# EAGLE design Lagopus_B (EAGLE 8.0.0)
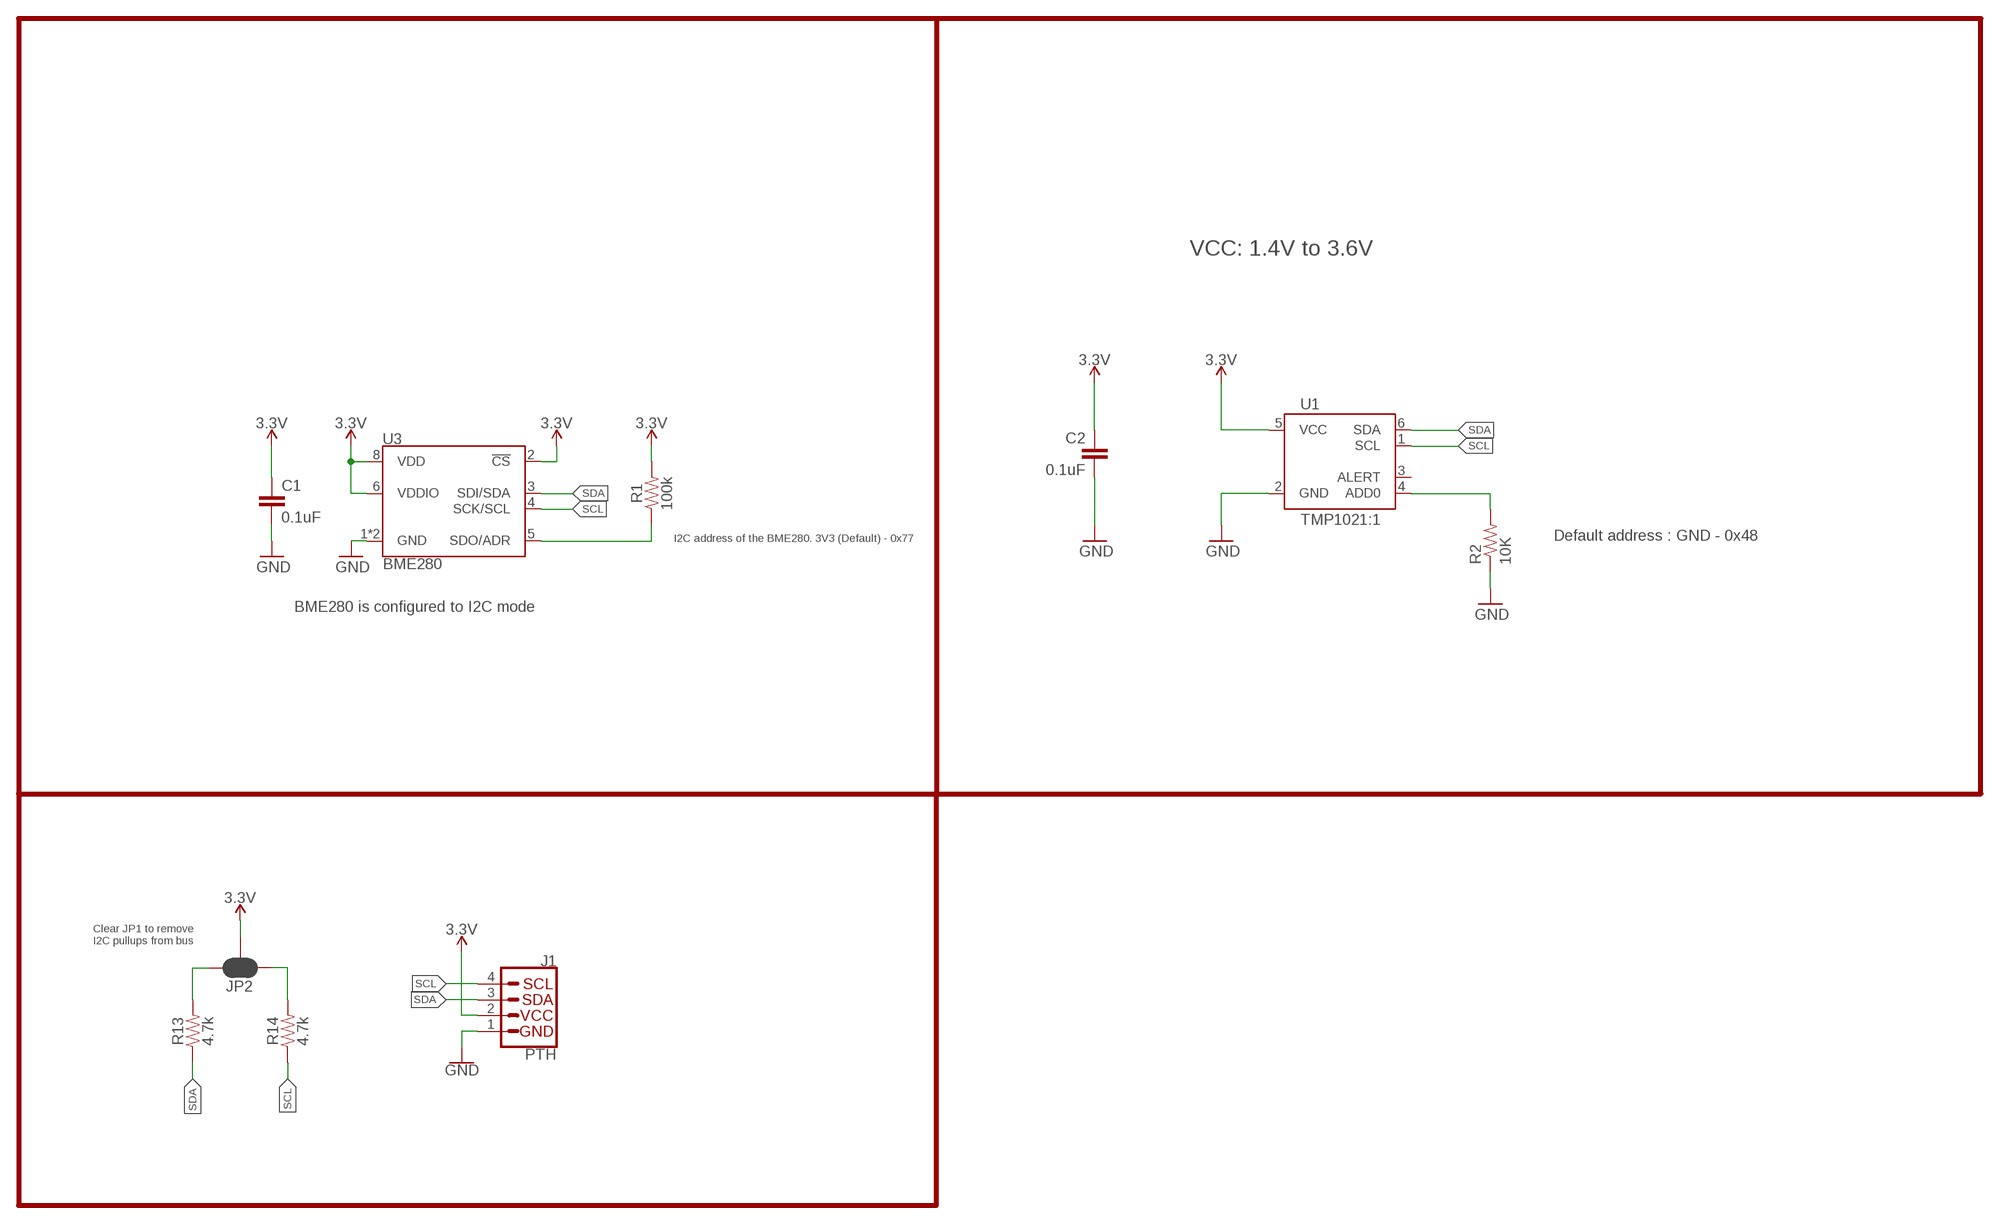
[diagram p0: schematic, sheet 1]

## Parts
C1  0.1uF  0.1UF-0603-25V-(+80/-20%)  [0603]
C2  0.1uF  0.1UF-25V(+80/-20%)(0603)  [0603-CAP]
J1  PTH  I2C_STANDARD_NO_SILK  [1X04_NO_SILK]
JP2  JUMPER-SMT_3_2-NC_PASTE_SILK  [SMT-JUMPER_3_2-NC_PASTE_SILK]
R1  100k  100KOHM-0603-1/10W-1%  [0603]
R2  10K  10KOHM-1/10W-1%(0603)0603  [0603-RES]
R13  4.7k  4.7KOHM-0603-1/10W-1%  [0603]
R14  4.7k  4.7KOHM-0603-1/10W-1%  [0603]
U1  TMP1021:1  [SOT563-2]
U3  BME280  [LGA-8-2.5X2.5]

## Nets
3.3V: C1.1 C2.1 J1.2(VCC) JP2.2 R1.2 U1.5(VCC) U3.2(!CS) U3.6(VDDIO) U3.8(VDD)
ADD0: R2.2 U1.4(ADD0)
GND: C1.2 C2.2 J1.1(GND) R2.1 U1.2(GND) U3.1(GND) U3.7(GND)
N$7: JP2.3 R13.2
N$8: JP2.1 R14.2
SCL: J1.4(SCL) R14.1 U1.1(SCL) U3.4(SCK/SCL)
SDA: J1.3(SDA) R13.1 U1.6(SDA) U3.3(SDI/SDA)
SDO/ADR: R1.1 U3.5(SDO/ADR)
Unconnected: U1.3(ALERT)

## Notes on the sheet
- VCC: 1.4V to 3.6V
- I2C address of the BME280. 3V3 (Default) - 0x77
- Default address : GND - 0x48
- BME280 is configured to I2C mode
- Clear JP1 to remove
  I2C pullups from bus

## Library data of the parts
C1 = SparkFun-Capacitors:0.1UF: 0.1µF ceramic capacitors A capacitor is a passive two-terminal electrical component used to store electrical energy temporarily in an electric field.; PROD_ID: CAP-00810
C2 = SparkFun-Capacitors:0.1UF-25V(+80/-20%)(0603): CAP-00810 Ceramic Standard decoupling cap; PROD_ID: CAP-00810
J1 = SparkX:I2C_STANDARD: SparkFun I2C Standard Pinout Header SparkFun has standardized on a pinout for all I2C based sensor breakouts. This pinout allows I2C boards to be plugged directly into the headers on Arduino Uno compatible boards, and to be daisy chained easily. Example SparkFun Products: SparkFun Atmospheric Sensor Breakout - BME280 <https://www.sparkfun.com/products/13676> SparkFun Altitude/Pressure Sensor Breakout - MPL3115A2 <https://www.sparkfun.com/products/11084> SparkFun TOF Range Finder Sensor - VL6180 <https://www.sparkfun.com/products/12785>
JP2 = SparkFun-Jumpers:JUMPER-SMT_3_2-NC_PASTE: Normally closed solder jumper (2 of 2 connections) This jumper has an aperture in the stencil to allow solder paste to bridge both connections. Both connections are normally closed (NC). Wick off the solder to open the connection(s). Reapply solder to reclose the connection(s).
R1 = SparkFun-Resistors:100KOHM: 100kΩ resistor A resistor is a passive two-terminal electrical component that implements electrical resistance as a circuit element. Resistors act to reduce current flow, and, at the same time, act to lower voltage levels within circuits. - Wikipedia; PROD_ID: RES-07828
R2 = SparkFun-Resistors:10KOHM-1/10W-1%(0603): RES-00824; PROD_ID: RES-00824
R13 R14 = SparkFun-Resistors:4.7KOHM: 4.7kΩ resistor A resistor is a passive two-terminal electrical component that implements electrical resistance as a circuit element. Resistors act to reduce current flow, and, at the same time, act to lower voltage levels within circuits. - Wikipedia; PROD_ID: RES-07857
U1 = SparkFun-Sensors:TMP102: I2C degC temp sensor; PROD_ID: IC-09303
U3 = SparkFun-Sensors:BME280: Bosch BME280 – Combined Humidity and Pressure Sensor The BME280 is as combined digital humidity, pressure and temperature sensor based on proven sensing principles. The sensor module is housed in an extremely compact metal-lid LGA package with a footprint of only 2.5×2.5mm² with a height of 0.93mm. Its small dimensions and its low power consumption allow the implementation in battery driven devices such as handsets, GPS modules or watches. Datasheet <https://cdn.sparkfun.com/assets/learn_tutorials/4/1/9/BST-BME280_DS001-10.pdf> SparkFun Products SparkFun Atmospheric Sensor Breakout - BME280 <https://www.sparkfun.com/products/13676> (SEN-13676); PROD_ID: IC-13090

## Board
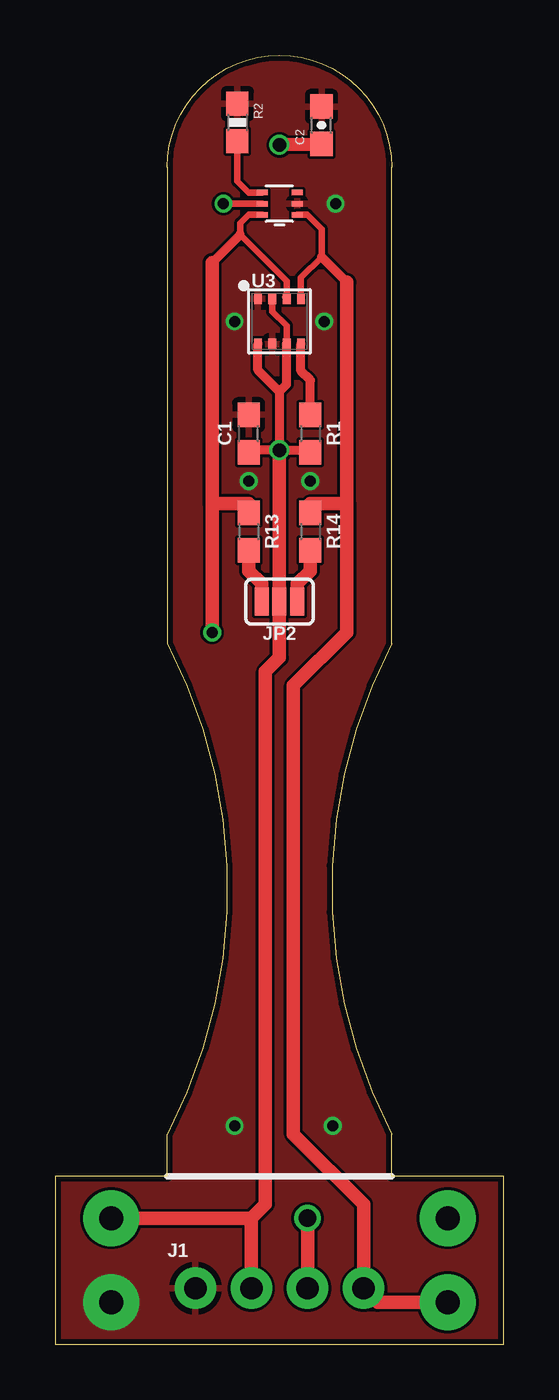
[diagram p1: board, top side]
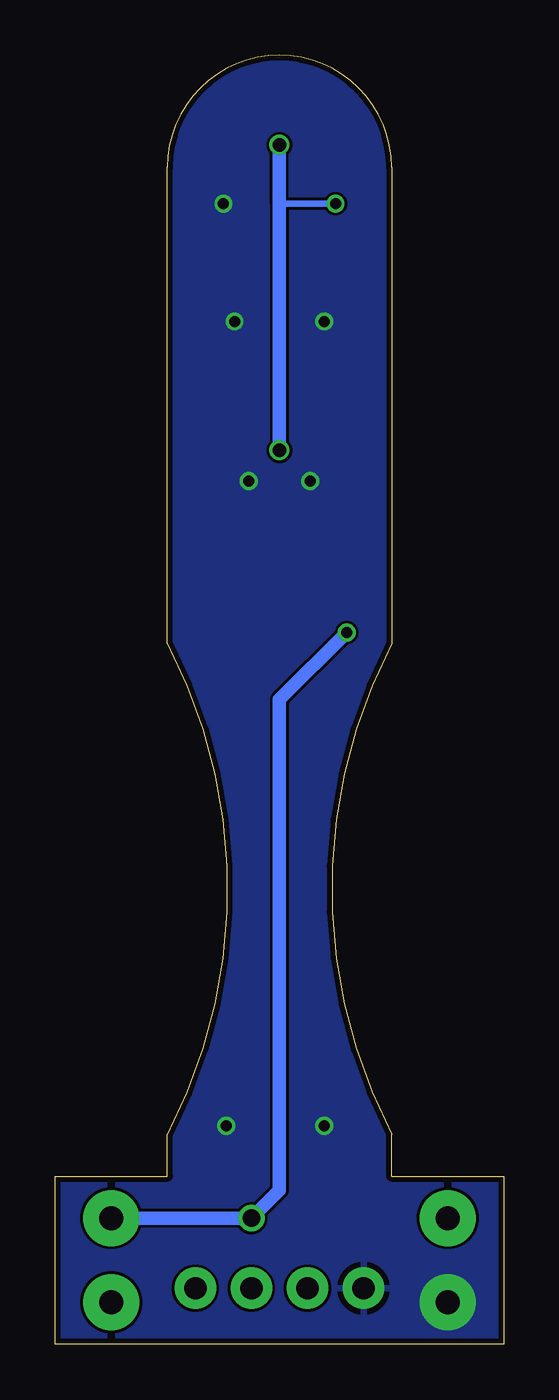
[diagram p2: board, bottom side, seen from below]

Size 20.32 x 58.42 mm. Coordinates in mm from the lower left corner, seen from the top.
Outline: 0,0 20.32,0 20.32,7.62 15.24,7.62 15.24,9.53 arc-55 15.24,31.75 15.24,53.34 arc180 5.08,53.34 5.08,31.75 arc-55 5.08,9.53 5.08,7.62 0,7.62 0,0
Copper layers (1*16): Top 0.035mm / dielectric 1.5mm / Bottom 0.035mm
Design rules "dirt_cheap_dirty_boards.v1": minimum track width 5mil, minimum drill 12mil, track to track 5mil, track to pad 5mil, pad to pad 5mil, via to via 5mil, smd to smd 0mil, copper to edge 10mil, drill to drill 10mil, minimum pad ring 10mil, minimum via ring 6mil, stop-mask expansion 2mil, vias tented up to drill 25mil, thermal gap 10mil

### Footprints (pad centres in the part's own frame; a part is rotated, then mirrored left to right if it is on the bottom)
0603 = smd 1.1 x 1: 1 -0.85,0; 2 0.85,0
0603-CAP = smd 1.1 x 1: 1 -0.85,0; 2 0.85,0
1X04_NO_SILK = drill 1.016 pad 1.88: 1 0,0; 2 2.54,0; 3 5.08,0; 4 7.62,0
SMT-JUMPER_3_2-NC_PASTE_SILK = smd 0.635 x 1.27: 1 -0.813,0; 2 0,0; 3 0.813,0
0603-RES = smd 1.1 x 1: 1 -0.85,0; 2 0.85,0
SOT563-2 = smd 0.508 x 0.249: 1 -0.8,0.498; 2 -0.8,0.003; 3 -0.8,-0.506; 4 0.776,-0.506; 5 0.776,0.003; 6 0.776,0.498
LGA-8-2.5X2.5 = smd 0.35 x 0.5: 1 -0.975,1.025; 2 -0.325,1.025; 3 0.325,1.025; 4 0.975,1.025; 5 0.975,-1.025; 6 0.325,-1.025; 7 -0.325,-1.025; 8 -0.975,-1.025

### Placement (x,y rotation side)
C1  8.76,41.27 90 top
C2  12.06,55.24 90 top
J1  6.35,2.54 0 top
JP2  10.16,33.66 180 top
R1  11.56,41.27 270 top
R2  8.26,55.37 270 top
R13  8.76,36.83 270 top
R14  11.56,36.83 270 top
U1  10.16,51.69 180 top
U3  10.16,46.35 0 top

### Tracks (layer width: path | path; a pad name or v marks a point on that pad's centre or on a via)
3.3V  (via drill 0.5, 0.6, 1.1 pad 2.54)
  Top 0.305: U1.5 v7.62,51.69 | U3.6 10.48,46.16 9.84,46.81 U3.2
  Top 0.406: 10.16,43.18 v10.16,40.51 | U3.6 10.48,43.5 10.16,43.18 | U3.8 9.19,44.15 10.16,43.18 | v10.16,40.51 11.47,40.51 R1.2 | v10.16,40.51 8.85,40.51 C1.1
  Top 0.61: v10.16,54.36 C2.1 | v2.54,5.71 8.89,5.71 | 8.89,5.71 J1.2 | 8.89,5.71 9.53,6.35 9.53,30.48 10.16,31.12 JP2.2 v10.16,40.51
  Bottom 0.305: v7.62,51.69 10.16,51.69
  Bottom 0.61: v10.16,40.51 10.16,51.69 v10.16,54.36
ADD0
  Top 0.305: U1.4 8.76,52.2 8.26,52.7 R2.2
GND  (via drill 0.5, 1.1 pad 2.54)
  other vias: 8.13,46.35 12.19,46.35 12.7,51.69 8.76,39.12 11.56,39.12 2.54,1.91 12.57,9.91 8.13,9.91
  pour Bottom: -1.02,59.69 -1.02,-1.65 21.34,-1.65 21.34,59.69
  pour Top: -1.02,59.69 21.34,59.69 21.34,-1.65 -1.02,-1.65
N$7
  Top 0.61: JP2.3 9.35,34.47 8.76,35.05 R13.2
N$8
  Top 0.61: JP2.1 10.97,34.47 11.56,35.05 R14.2
SCL  (via drill 1.1 pad 2.54)
  Top 0.305: 11.18,47.42 U3.4 11.13,48.35 12.06,49.28 12.06,50.55 11.42,51.19 U1.1
  Top 0.406: 12.06,49.28 13.21,48.13
  Top 0.61: 13.21,38.1 13.21,48.13 | 13.21,38.1 13.21,32.26 10.79,29.85 10.79,9.53 13.97,6.35 J1.4 14.61,1.91 v17.78,1.91 | R14.1 11.56,38.1 13.21,38.1
SDA  (via drill 0.5, 0.8, 1.1 pad 2.54)
  Top 0.305: 10.41,47.45 U3.3 10.48,48.19 8.38,50.29 8.38,50.8 8.77,51.19 U1.6
  Top 0.406: 7.11,49.02 8.38,50.29
  Top 0.61: 7.11,38.1 v7.11,32.26 | 7.11,38.1 7.11,49.02 | v11.43,5.71 J1.3 | R13.1 8.76,38.1 7.11,38.1
  Bottom 0.61: v7.11,32.26 10.16,29.21 10.16,6.99 v11.43,5.71 v17.78,5.71
SDO/ADR
  Top 0.406: R1.1 11.56,43.69 11.13,44.11 U3.5